# EAGLE design audiomeaskit (EAGLE 7.7.0)
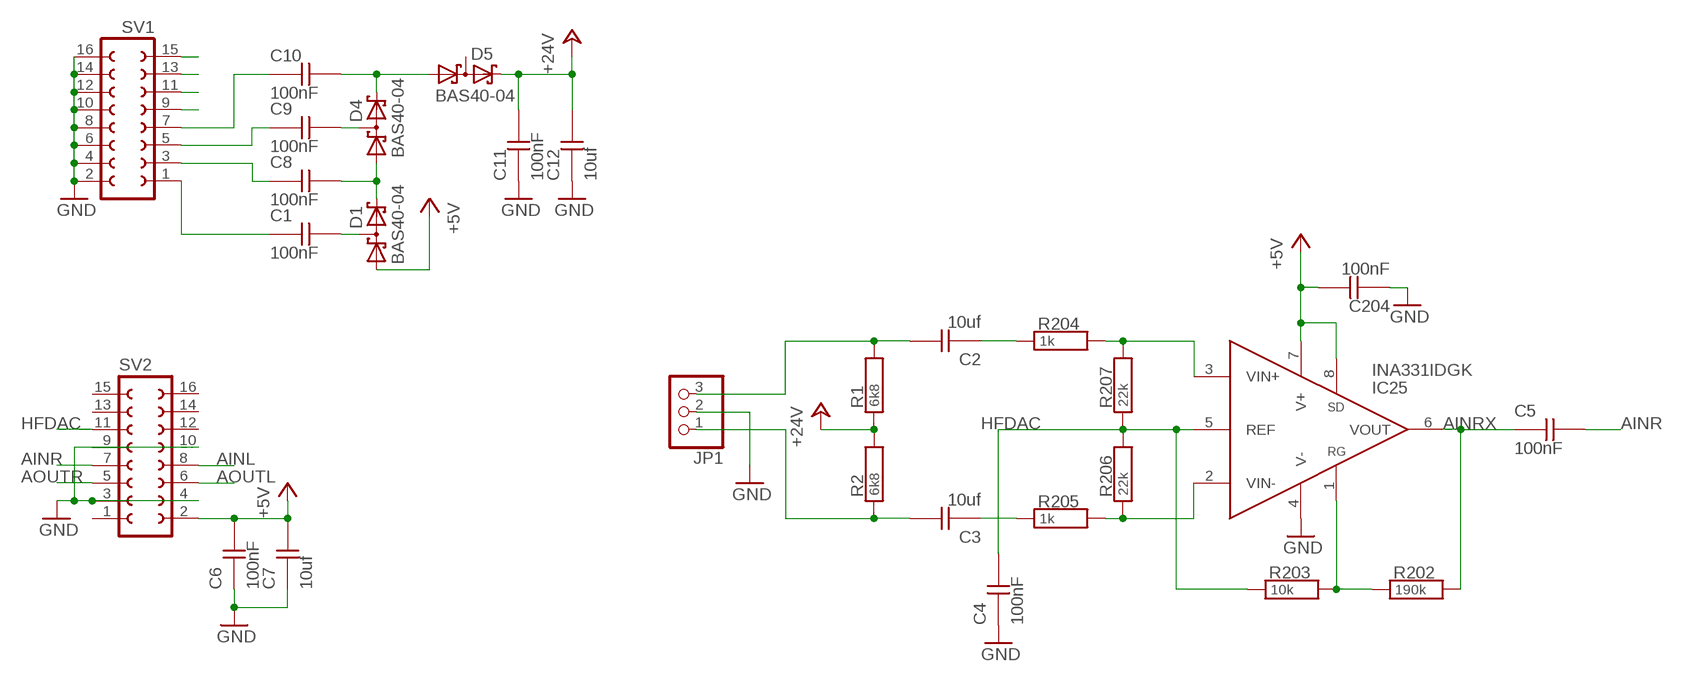
[diagram p0: schematic, sheet 1]

## Parts
C1  100nF  CAPC0603  [0603]
C2  10uf  CAPC0805  [0805]
C3  10uf  CAPC0805  [0805]
C4  100nF  CAPC0603  [0603]
C5  100nF  CAPC0603  [0603]
C6  100nF  CAPC0603  [0603]
C7  10uf  CAPC0805  [0805]
C8  100nF  CAPC0603  [0603]
C9  100nF  CAPC0603  [0603]
C10  100nF  CAPC0603  [0603]
C11  100nF  CAPC0603  [0603]
C12  10uf  CAPC0805  [0805]
C204  100nF  CAPC0402  [0402]
D1  BAS40-04  [SOT23]
D4  BAS40-04  [SOT23]
D5  BAS40-04  [SOT23]
IC25  INA331IDGK  [MSOP08]
JP1  PINHD-1X3  [1X03]
R1  6k8  RESR0603  [0603]
R2  6k8  RESR0603  [0603]
R202  190k  RESR0603  [0603]
R203  10k  RESR0603  [0603]
R204  1k  RESR0603  [0603]
R205  1k  RESR0603  [0603]
R206  22k  RESR0603  [0603]
R207  22k  RESR0603  [0603]
SV1  FE08-2  [FE08-2]
SV2  FE08-2  [FE08-2]

## Nets
+5V: C6.2 C7.2 C204.2 D1.1(A1) IC25.7(V+) IC25.8(SD) SV2.2
+24V: C11.2 C12.2 D5.2(C2) R1.1 R2.2
AINL: SV2.8
AINR: C5.2 SV2.7
AINRX: C5.1 IC25.6(VOUT) R202.2
AOUTL: SV2.6
AOUTR: SV2.5
GND: C4.1 C6.1 C7.1 C11.1 C12.1 C204.1 IC25.4(V-) JP1.2 SV1.2 SV1.4 SV1.6 SV1.8 SV1.10 SV1.12 SV1.14 SV1.16 SV2.3 SV2.4 SV2.9 SV2.10
HFDAC: C4.2 IC25.5(REF) R203.1 R206.2 R207.1 SV2.11
N$1: C8.1 SV1.3
N$3: C3.2 JP1.1 R2.1
N$4: C2.2 JP1.3 R1.2
N$6: C1.1 SV1.1
N$7: C1.2 D1.3(C1A2)
N$8: C10.1 SV1.7
N$9: C8.2 D1.2(C2) D4.1(A1)
N$11: C9.1 SV1.5
N$12: C9.2 D4.3(C1A2)
N$13: C10.2 D4.2(C2) D5.1(A1)
N$225: IC25.1(RG) R202.1 R203.2
N$226: IC25.3(VIN+) R204.2 R207.2
N$227: IC25.2(VIN-) R205.2 R206.1
N$228: C2.1 R204.1
N$229: C3.1 R205.1
S1: SV1.9
S2: SV1.11
S3: SV1.13
S4: SV1.15
Unconnected: D5.3(C1A2) SV2.1 SV2.12 SV2.13 SV2.14 SV2.15 SV2.16

## Library data of the parts
C1-C12 C204 = passive:CAP
D1 D4 D5 = diode:BAS40-04: Silicon Schottky Diodes General-purpose diode for high-speed switching
IC25 = amplifiers-and-linear:INA331
JP1 = pinhead:PINHD-1X3: PIN HEADER
R1 R2 R202-R207 = passive:RES
SV1 SV2 = con-lsta:FE08-2: FEMALE HEADER; OC_FARNELL: unknown; OC_NEWARK: unknown

## Board
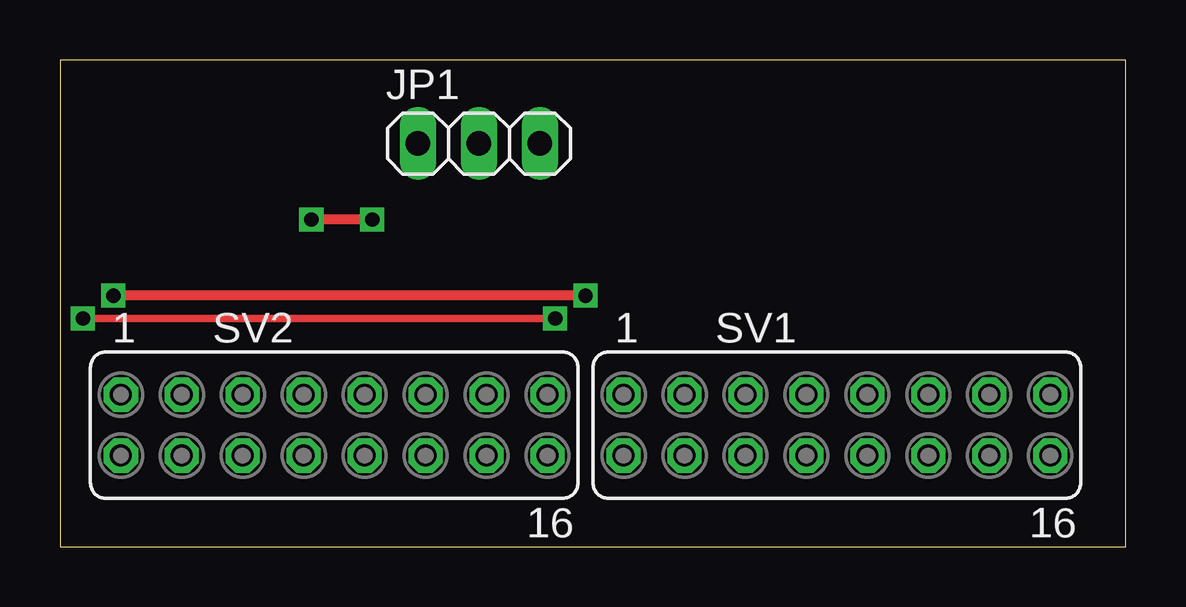
[diagram p1: board, top side]
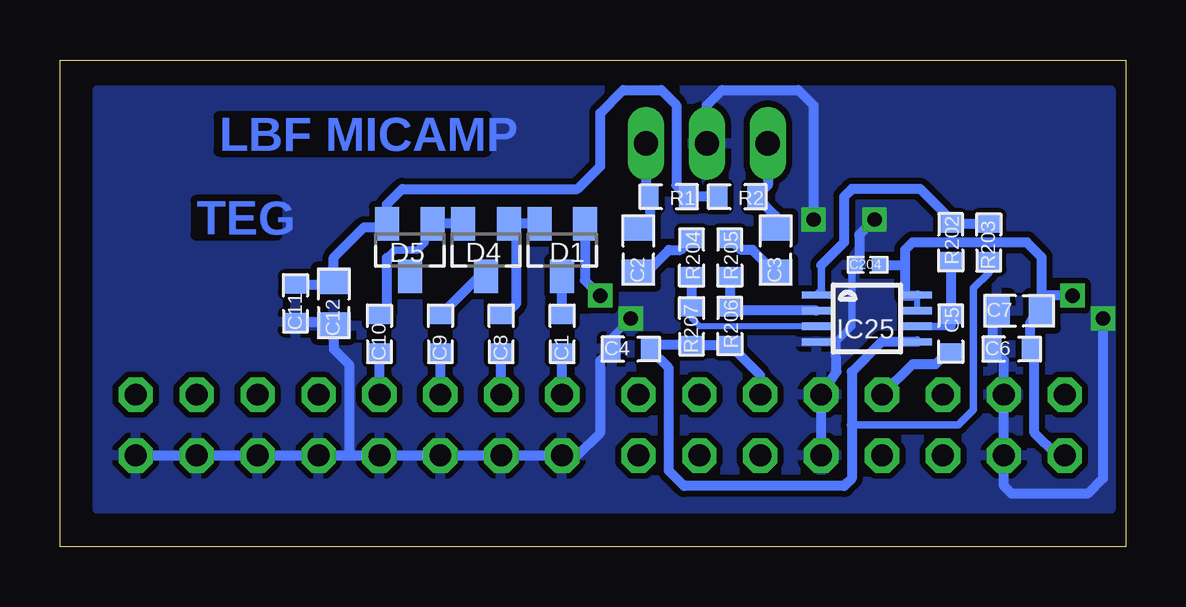
[diagram p2: board, bottom side, seen from below]

Size 44.43 x 20.31 mm. Coordinates in mm from the lower left corner, seen from the top.
Outline: 0,0 44.43,0 44.43,20.31 0,20.31 0,0
Copper layers (1*16): Top 0.035mm / dielectric 1.5mm / Bottom 0.035mm
Design rules "default *": minimum track width 10mil, minimum drill 0.6mm, track to track 8mil, track to pad 8mil, pad to pad 8mil, via to via 8mil, smd to smd 2mil, copper to edge 10mil, drill to drill 8mil, minimum pad ring 10mil, minimum via ring 8mil, stop-mask expansion 4mil, vias tented up to drill 0mil, thermal gap 10mil

### Footprints (pad centres in the part's own frame; a part is rotated, then mirrored left to right if it is on the bottom)
0603 = smd 0.762 x 0.965: 1 -0.787,0; 2 0.787,0
0805 = smd 1.092 x 1.397: 1 -0.94,0; 2 0.94,0
0402 = smd 0.635 x 0.635: 1 -0.498,0; 2 0.523,0
SOT23 = smd 1 x 1.4: 1 -0.95,-1.1; 2 0.95,-1.1; 3 0,1.1
MSOP08 = smd 0.3 x 1.2: 1 -0.976,-2.113; 2 -0.326,-2.113; 3 0.324,-2.113; 4 0.974,-2.113; 5 0.974,2.112; 6 0.324,2.112; 7 -0.326,2.112; 8 -0.976,2.112
1X03 = drill 1.016 long: 1 -2.54,0; 2 0,0; 3 2.54,0
FE08-2 = drill 0.914 octagon: 1 -8.89,1.27; 2 -8.89,-1.27; 3 -6.35,1.27; 4 -6.35,-1.27; 5 -3.81,1.27; 6 -3.81,-1.27; 7 -1.27,1.27; 8 -1.27,-1.27; 9 1.27,1.27; 10 1.27,-1.27; 11 3.81,1.27; 12 3.81,-1.27; 13 6.35,1.27; 14 6.35,-1.27; 15 8.89,1.27; 16 8.89,-1.27

### Placement (x,y rotation side)
C1  23.5,8.89 90 bottom
C2  20.32,12.38 90 bottom
C3  14.61,12.38 90 bottom
C4  20.64,8.26 0 bottom
C5  7.3,8.89 270 bottom
C6  4.76,8.26 0 bottom
C7  4.45,9.84 0 bottom
C8  26.04,8.89 90 bottom
C9  28.57,8.89 90 bottom
C10  31.11,8.89 90 bottom
C11  34.61,10.16 90 bottom
C12  33.02,10.16 90 bottom
C204  10.79,11.75 0 bottom
D1  23.5,12.38 180 bottom
D4  26.67,12.38 180 bottom
D5  29.84,12.38 180 bottom
IC25  10.79,9.53 270 bottom
JP1  17.46,16.83 0 top
R1  19.05,14.61 180 bottom
R2  16.19,14.61 180 bottom
R202  7.3,12.7 270 bottom
R203  5.71,12.7 90 bottom
R204  18.1,12.06 270 bottom
R205  16.51,12.06 270 bottom
R206  16.51,9.21 270 bottom
R207  18.1,9.21 90 bottom
SV1  32.38,5.08 0 top
SV2  11.43,5.08 0 top

### Tracks (layer width: path | path; a pad name or v marks a point on that pad's centre or on a via)
+5V  (via drill 0.6)
  Top 0.406: v21.91,10.48 v2.22,10.48
  Bottom 0.254: IC25.7 IC25.8
  Bottom 0.406: SV2.2 2.86,3.81 3.81,4.76 3.81,8.09 C6.2 3.98,9.37 C7.2 3.5,10.48 | 3.5,10.48 3.5,12.08 4.13,12.7 8.89,12.7 9.21,12.38 9.21,11.75 | 9.21,11.75 9.21,10.48 8.71,10.48 IC25.8 | C204.2 9.21,11.75 | D1.1 22.55,11.12 v21.91,10.48 | v2.22,10.48 3.5,10.48
+24V
  Bottom 0.406: R2.2 R1.1 18.73,15.07 18.73,18.41 19.37,19.05 20.95,19.05 21.91,18.1 21.91,15.88 22.86,14.92 30.16,14.92 30.8,14.29 D5.2 30.94,13.34 31.75,13.34 33.02,12.06 C12.2 33.17,10.95 C11.2
AINR
  Bottom 0.406: C5.2 7.46,8.1 7.94,7.62 8.89,7.62 SV2.7
AINRX
  Bottom 0.305: IC25.6 7.31,9.2 7.3,9.21
  Bottom 0.406: R202.2 C5.1 | C5.1 7.3,9.21 | 7.31,9.2 C5.1
GND  (via drill 0.6)
  Top 0.305: v20.64,9.53 v0.95,9.53
  Top 0.406: v13.02,13.65 v10.48,13.65
  Bottom 0.305: IC25.4 12.09,8.55 11.43,9.21 11.43,11.61 C204.1 | C4.1 21.43,8.74 v20.64,9.53
  Bottom 0.406: C7.1 5.55,9.68 C6.1 5.08,7.79 SV2.3 SV2.4 5.08,2.54 4.76,2.22 1.59,2.22 0.95,2.86 v0.95,9.53 | SV2.10 SV2.9 12.06,7.3 12.09,8.55 | C11.1 33.17,9.37 C12.1 33.02,8.26 32.38,7.62 32.38,3.81 | SV1.16 SV1.14 SV1.12 SV1.10 32.38,3.81 | 32.38,3.81 SV1.8 SV1.6 SV1.4 SV1.2 22.86,3.81 21.91,4.76 21.91,7.77 C4.1 | JP1.2 17.46,18.41 16.83,19.05 13.65,19.05 13.02,18.41 v13.02,13.65 | v10.48,13.65 11.11,13.02 11.11,11.93 C204.1
  pour Bottom (isolate 0.254): 0.64,1.59 42.86,1.59 42.86,19.05 0.64,19.05
HFDAC
  Bottom 0.305: R203.1 5.71,11.43 6.35,10.79 6.35,5.71 6.99,5.08 11.43,5.08
  Bottom 0.406: IC25.5 8.71,8.57 10.16,8.57 11.43,7.3 11.43,5.08 11.43,2.86 11.75,2.54 18.41,2.54 19.05,3.17 19.05,7.46 C4.2 19.68,8.42 R207.1 R206.2 15.24,7.15 SV2.11
N$1
  Bottom 0.406: SV1.3 C8.1
N$3
  Bottom 0.406: JP1.1 14.92,15.09 R2.1 14.61,13.8 C3.2
N$4
  Bottom 0.406: JP1.3 20,14.77 R1.2 19.84,13.8 C2.2
N$6
  Bottom 0.406: SV1.1 C1.1
N$7
  Bottom 0.406: C1.2 D1.3
N$8
  Bottom 0.406: SV1.7 C10.1
N$9
  Bottom 0.406: D1.2 D4.1 25.4,13.16 25.4,10.16 25.88,9.68 C8.2
N$11
  Bottom 0.406: SV1.5 C9.1
N$12
  Bottom 0.406: D4.3 26.97,11.28 C9.2
N$13
  Bottom 0.305: 30.8,12.06 30.48,12.38 29.53,12.38 29.21,12.7 29.21,13.17 D5.1
  Bottom 0.406: C10.2 30.96,9.68 30.8,9.84 30.8,12.06 | D4.2 D5.1
N$225
  Bottom 0.305: 12.7,11.75 12.7,10.71 IC25.1
  Bottom 0.406: 7.14,13.49 8.57,14.92 11.43,14.92 11.75,14.61 11.75,12.7 12.7,11.75 | R202.1 7.14,13.49 | 7.14,13.49 R203.2
N$226
  Bottom 0.254: R207.2 18.1,9.53 17.78,9.21 IC25.3
  Bottom 0.406: 18.26,11.11 R204.2 18.1,11.11 18.1,10.79 R207.2
N$227
  Bottom 0.406: IC25.2 16.05,9.85 R206.1 R205.2
N$228
  Bottom 0.406: C2.1 19.99,11.44 19.05,12.38 18.57,12.38 R204.1
N$229
  Bottom 0.406: C3.1 15.56,12.38 16.04,12.38 R205.1

### Text on the board
Bottom: LBF MICAMP | TEG